# Altium schematic sheet TOP.SchDoc
size A
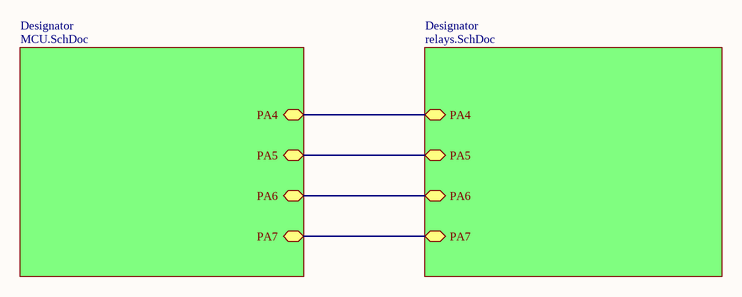
[diagram p0: TOP.SchDoc]

## Sub-sheets
Designator = MCU.SchDoc: PA4, PA5, PA6, PA7
Designator = relays.SchDoc: PA4, PA5, PA6, PA7

## Nets
(unnamed): sheet Designator/PA4, sheet Designator/PA4
(unnamed): sheet Designator/PA5, sheet Designator/PA5
(unnamed): sheet Designator/PA6, sheet Designator/PA6
(unnamed): sheet Designator/PA7, sheet Designator/PA7